# Altium project WTC_SPI_v2.PrjPcb
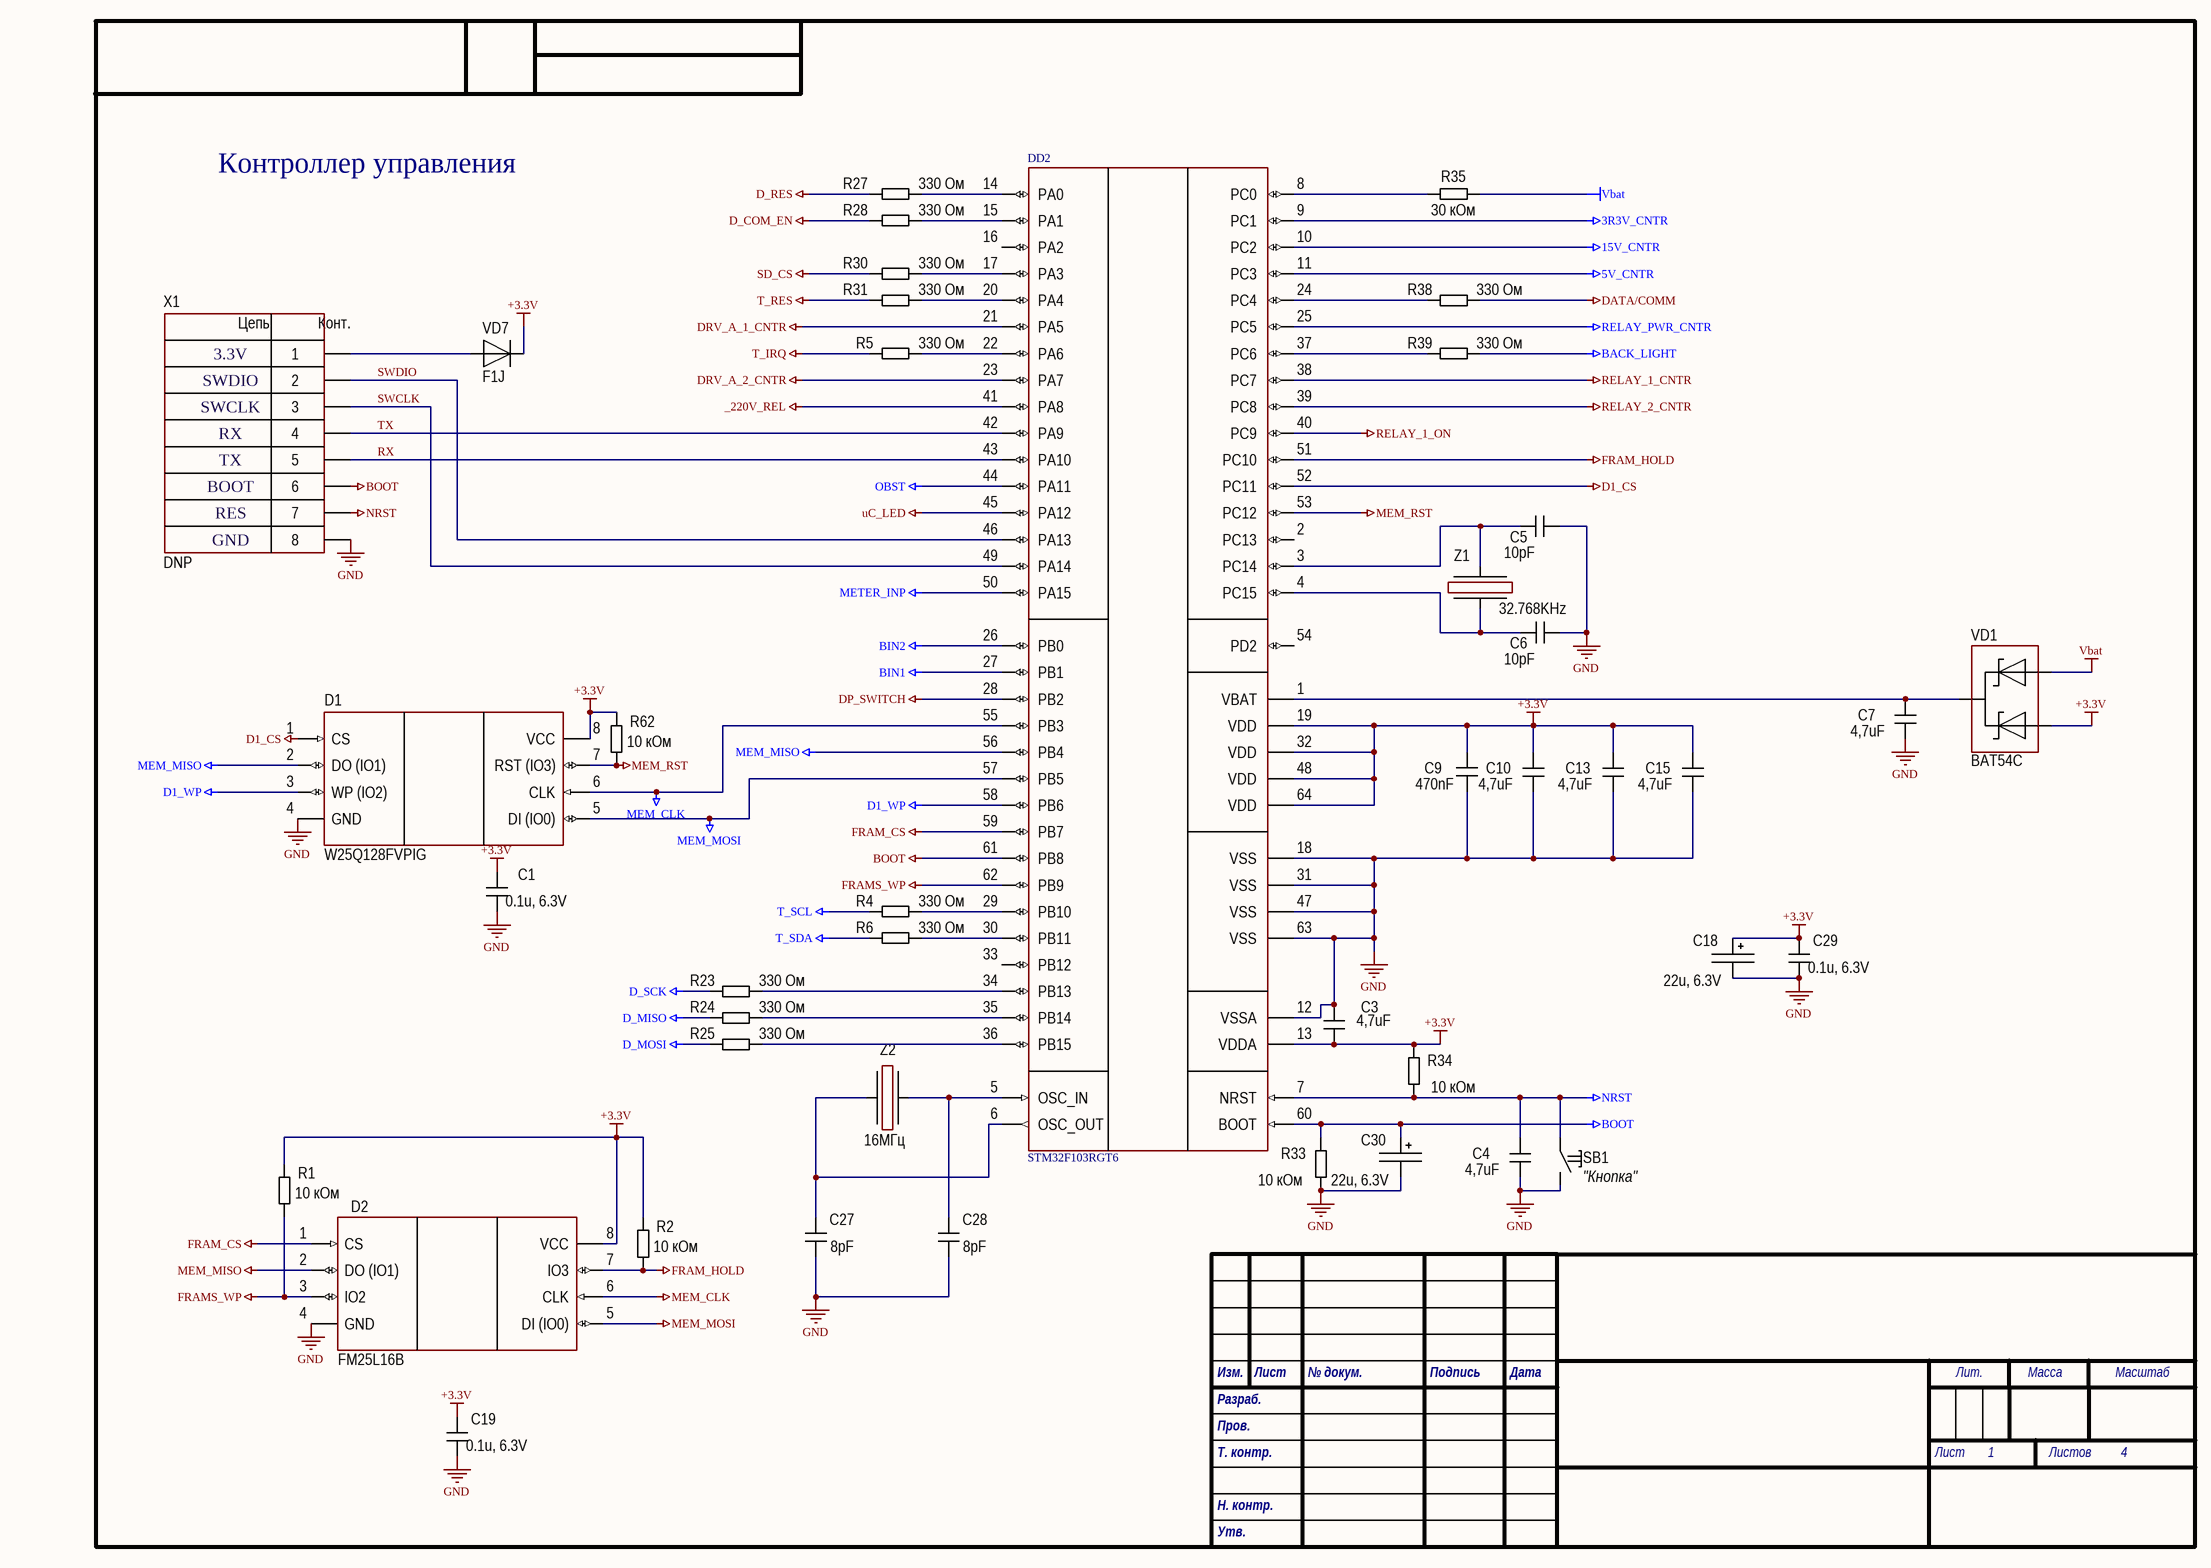
[diagram p0: 1_uC.SchDoc]
4 sheets, 168 parts. Net scope: global (net labels, ports and power ports of the same name join across sheets).
Board file: wtc_spi.PcbDoc
Sheets:
  1_uC.SchDoc
  2_PowerPerif.SchDoc
  3_InfoPerif.SchDoc
  4_PowerSupplie.SchDoc

## Sheet 1_uC.SchDoc
size 414 x 293 mm; SheetNumber: 1; SheetTotal: 4

### Parts
C1  0.1u, 6.3V  [CH0402C]
C3  4,7uF  [CH0402C]
C4  4,7uF  [CH0402C]
C5  10pF  [CH0402C]
C6  10pF  [CH0402C]
C7  4,7uF  [CH0402C]
C9  470nF  [CH0402C]
C10  4,7uF  [CH0402C]
C13  4,7uF  [CH0402C]
C15  4,7uF  [CH0402C]
C18  22u, 6.3V  [TANTAL_A]
C19  0.1u, 6.3V  [CH0402C]
C27  8pF  [CH0402C]
C28  8pF  [CH0402C]
C29  0.1u, 6.3V  [CH0402C]
C30  22u, 6.3V  [TANTAL_A]
D1  W25Q128FVPIG  [8-WSON (5x6mm)without_holes]
D2  FM25L16B  [8-SOIC]
DD2  STM32F103RGT6  [64-LQFP]
R1  10 кОм  [CH0402R]
R2  10 кОм  [CH0402R]
R4  330 Ом  [CH0402R]
R5  330 Ом  [CH0402R]
R6  330 Ом  [CH0402R]
R23  330 Ом  [CH0402R]
R24  330 Ом  [CH0402R]
R25  330 Ом  [CH0402R]
R27  330 Ом  [CH0402R]
R28  330 Ом  [CH0402R]
R30  330 Ом  [CH0402R]
R31  330 Ом  [CH0402R]
R33  10 кОм  [CH0402R]
R34  10 кОм  [CH0402R]
R35  30 кОм  [CH0402R]
R38  330 Ом  [CH0402R]
R39  330 Ом  [CH0402R]
R62  10 кОм  [CH0402R]
SB1  "Кнопка"  [TL1014BF160QG]
VD1  BAT54C  [SOT23_123]
VD7  F1J  [SOD123F]
X1  DNP  [CON: PBS-8]
Z1  32.768KHz  [OSC: 3215]
Z2  16МГц  [OSC: ABM3]

### Nets
3R3V_CNTR: DD2.9(PC1)
5V_CNTR: DD2.11(PC3)
15V_CNTR: DD2.10(PC2)
+3.3V: C1.2 C3.1 C9.1 C10.2 C13.2 C15.2 C18.1 C19.2 C29.2 D1.8(VCC) D2.8(VCC) DD2.13(VDDA) DD2.19(VDD) DD2.32(VDD) DD2.48(VDD) DD2.64(VDD) R1.2 R2.2 R34.2 R62.2 VD1.3 VD7.2
_220V_REL: DD2.41(PA8)
BACK_LIGHT: R39.1
BIN1: DD2.27(PB1)
BIN2: DD2.26(PB0)
BOOT: C30.1 DD2.60(BOOT) DD2.61(PB8) R33.2 X1.6
D1_CS: D1.1(CS) DD2.52(PC11)
D1_WP: D1.3(WP_(IO2)) DD2.58(PB6)
D_COM_EN: R28.1
D_MISO: R24.1
D_MOSI: R25.1
D_RES: R27.1
D_SCK: R23.1
DATA/COMM: R38.1
DP_SWITCH: DD2.28(PB2)
DRV_A_1_CNTR: DD2.21(PA5)
DRV_A_2_CNTR: DD2.23(PA7)
FRAM_CS: D2.1(CS) DD2.59(PB7)
FRAM_HOLD: D2.7(IO3) DD2.51(PC10) R2.1
FRAMS_WP: D2.3(IO2) DD2.62(PB9) R1.1
GND: C1.1 C3.2 C4.1 C5.2 C6.1 C7.1 C9.2 C10.1 C13.1 C15.1 C18.2 C19.1 C27.1 C28.1 C29.1 C30.2 D1.4(GND) D2.4(GND) DD2.12(VSSA) DD2.18(VSS) DD2.31(VSS) DD2.47(VSS) DD2.63(VSS) R33.1 SB1.2 X1.8
MEM_CLK: D1.6(CLK) D2.6(CLK) DD2.55(PB3)
MEM_MISO: D1.2(DO_(IO1)) D2.2(DO_(IO1)) DD2.56(PB4)
MEM_MOSI: D1.5(DI_(IO0)) D2.5(DI_(IO0)) DD2.57(PB5)
MEM_RST: D1.7(RST_(IO3)) DD2.53(PC12) R62.1
METER_INP: DD2.50(PA15)
NRST: C4.2 DD2.7(NRST) R34.1 SB1.1 X1.7
OBST: DD2.44(PA11)
RELAY_1_CNTR: DD2.38(PC7)
RELAY_1_ON: DD2.40(PC9)
RELAY_2_CNTR: DD2.39(PC8)
RELAY_PWR_CNTR: DD2.25(PC5)
RX: DD2.43(PA10) X1.5
SD_CS: R30.1
T_IRQ: R5.1
T_RES: R31.1
T_SCL: R4.1
T_SDA: R6.1
TX: DD2.42(PA9) X1.4
uC_LED: DD2.45(PA12)
Vbat: R35.1 VD1.1
SWCLK: DD2.49(PA14) X1.3
SWDIO: DD2.46(PA13) X1.2
NetC5_1: C5.1 DD2.3(PC14) Z1.3
NetC6_2: C6.2 DD2.4(PC15) Z1.1
NetC7_2: C7.2 DD2.1(VBAT) VD1.2
NetC27_2: C27.2 DD2.6(OSC_OUT) Z2.1
NetC28_2: C28.2 DD2.5(OSC_IN) Z2.3
NetDD2_8: DD2.8(PC0) R35.2
NetDD2_14: DD2.14(PA0) R27.2
NetDD2_15: DD2.15(PA1) R28.2
NetDD2_17: DD2.17(PA3) R30.2
NetDD2_20: DD2.20(PA4) R31.2
NetDD2_22: DD2.22(PA6) R5.2
NetDD2_24: DD2.24(PC4) R38.2
NetDD2_29: DD2.29(PB10) R4.2
NetDD2_30: DD2.30(PB11) R6.2
NetDD2_34: DD2.34(PB13) R23.2
NetDD2_35: DD2.35(PB14) R24.2
NetDD2_36: DD2.36(PB15) R25.2
NetDD2_37: DD2.37(PC6) R39.2
NetVD7_1: VD7.1 X1.1

Not connected (* = marked no-connect by the designer): DD2 2(PC13) 16(PA2) 33(PB12) 54(PD2)

### Notes on the sheet
- Контроллер управления
- 3.3V
- SWDIO
- SWCLK
- RX
- TX
- BOOT
- RES
- GND
- Изм.
- Лист
- № докум.
- Подпись
- Дата
- Лит.
- Масса
- Масштаб
- Пров.
- Разраб.
- Т. контр.
- Н. контр.
- Листов
- Утв.
- (in symbol 8-Connector) Цепь; Конт.

### Library data of the parts
C1 C19 C29 = Capacitor: Model: CC0402KRX7R5BB104; Manufacturer: *; HelpURL: *; ComponentKind: *; Value: *
C3 C4 C7 C10 C13 C15 = Capacitor: 0402; Model: C1005X5R0J475K050BC; Manufacturer: *; HelpURL: *; ComponentKind: *; Value: *
C5 C6 = Capacitor: 0402; Model: 04026D100JAT2A; Manufacturer: *; HelpURL: *; ComponentKind: *; Value: *
C9 = Capacitor: 0402; Model: C0402C474K9RAC7867; Manufacturer: *; HelpURL: *; ComponentKind: *; Value: *
C18 C30 = TantalCap: Model: T494A226M010AT; Manufacturer: *; HelpURL: *; ComponentKind: *; Value: *
C27 C28 = Capacitor: 0402; Model: 04025A8R2JAT2A; Manufacturer: *; HelpURL: *; ComponentKind: *; Value: *
D1 = W25Q128FVPIG: Flash; Manufacturer: Winbond Electronics; Model: W25Q128FVPIG; HelpURL: https://www.digikey.com/product-detail/en/winbond-electronics/W25Q128FVPIG/W25Q128FVPIG-ND/4037386; ComponentKind: 8-WSON
D2 = W25Q80JVSSIQ: Flash; Manufacturer: Winbond Electronics; Model: FM25L16B; HelpURL: https://www.digikey.com/product-detail/en/winbond-electronics/W25Q80JVSSIQ/W25Q80JVSSIQ-ND/6193772; ComponentKind: 8-SOIC
DD2 = STM32F103RCT6: Cortex-M3 (64-LQFP); Model: STM32F103RGT6
R1 R2 R62 = Resistor: 0603; Model: AC0402FR-0710KL; Manufacturer: *; HelpURL: *; ComponentKind: *; Value: *
R4-R6 R23-R25 R27 R28 R30 R31 R38 R39 = Resistor: 0603; Model: RC0402FR-07330RL; Manufacturer: *; HelpURL: *; ComponentKind: *; Value: *
R33 R34 = Resistor: 0805; Model: AC0402FR-0710KL; Manufacturer: *; HelpURL: *; ComponentKind: *; Value: *
R35 = Resistor: 0603; Model: AC0402FR-0730KL; Manufacturer: *; HelpURL: *; ComponentKind: *; Value: *
SB1 = Tactile switches: 6x6 mm; Manufacturer: *; Model: TL1014BF160QG; HelpURL: *; ComponentKind: *
VD1 = Diod Schottky Array v.1: SOT-23; ComponentKind: *; Manufacturer: *; Model: BAT54C; HelpURL: *
VD7 = Diod: ComponentKind: *; Manufacturer: *; Model: F1J; HelpURL: *
X1 = 8-Connector: Pin header 8; Model: DNP; Manufacturer: *; HelpURL: *; ComponentKind: *
Z1 = Oscillator: Model: Q 0,032768-JTX310-12,5-20-T1-LF; Manufacturer: *; HelpURL: *; ComponentKind: *; Value: *
Z2 = Oscillator: NX5032GA-16.000000MHZ-LN-CD-1; Manufacturer: *; Model: NX5032GA-16.000000MHZ-LN-CD-1; HelpURL: *; ComponentKind: *; Value: *

## Sheet 2_PowerPerif.SchDoc
size 414 x 293 mm; SheetNumber: 2; SheetTotal: 4
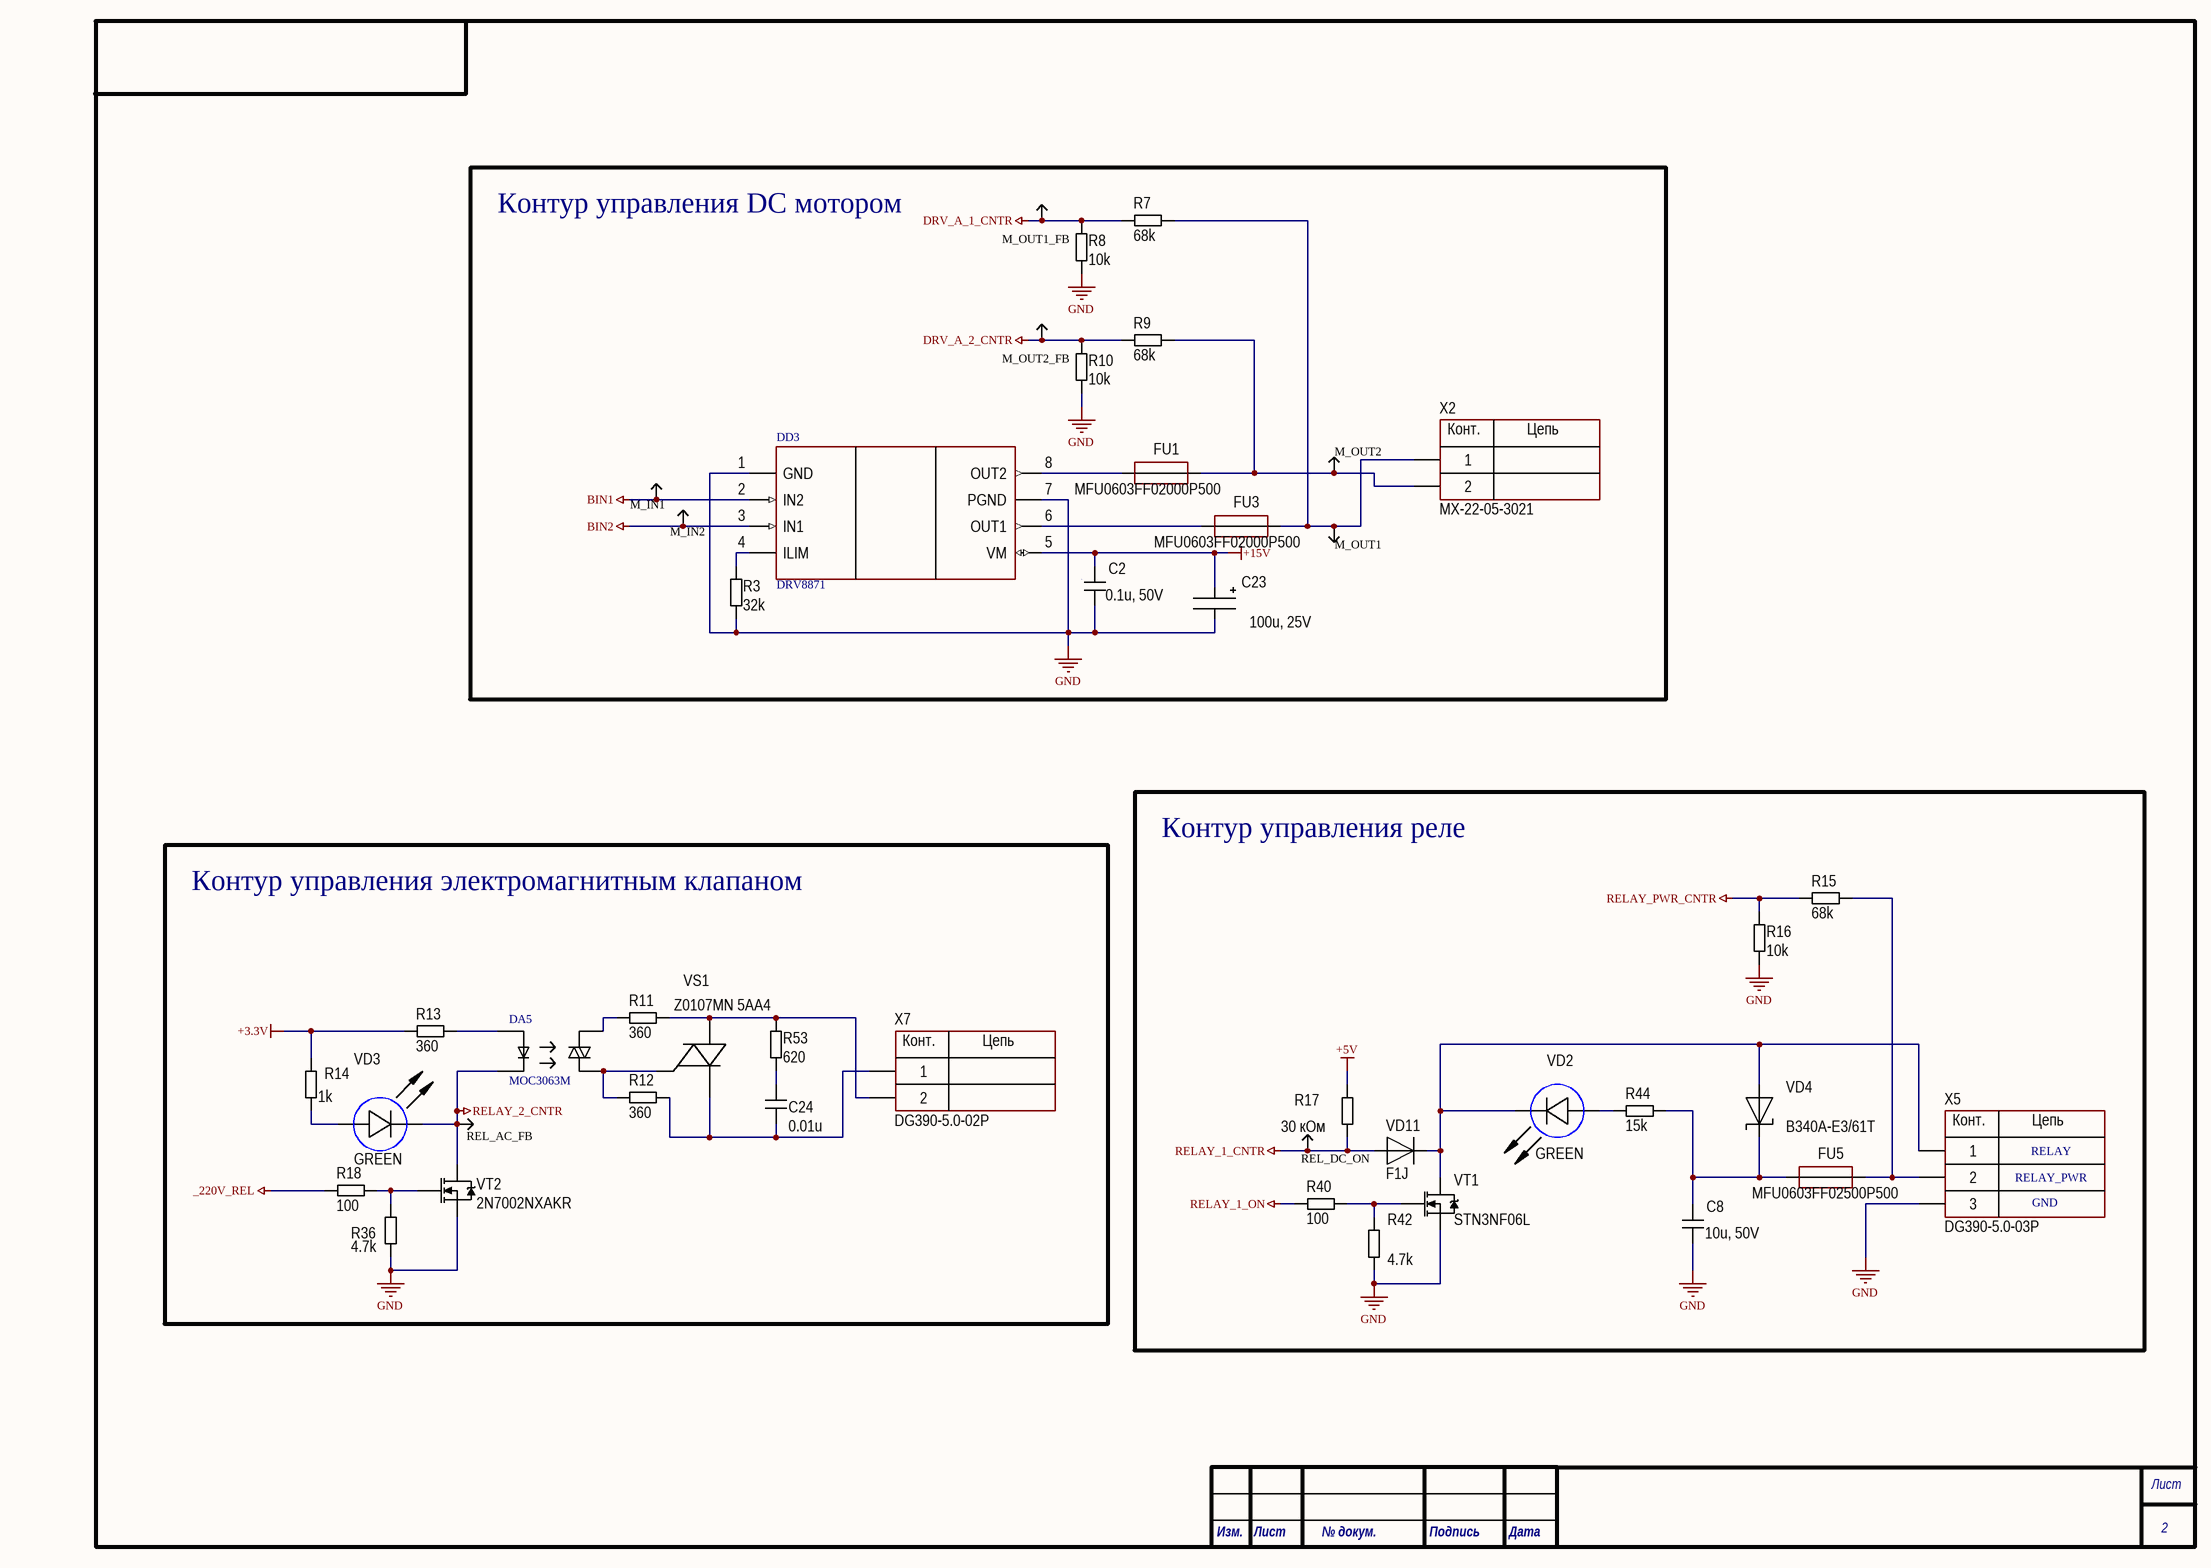
[diagram p1: 2_PowerPerif.SchDoc]

### Parts
C2  0.1u, 50V  [CH0402C]
C8  10u, 50V  [CH1206C]
C23  100u, 25V  [D6.6C6.6H6.1]
C24  0.01u  [CH1210C]
DA5  MOC3063M  [DIP6]
DD3  DRV8871  [8-HSOP]
FU1  MFU0603FF02000P500  [CH0603F]
FU3  MFU0603FF02000P500  [CH0603F]
FU5  MFU0603FF02500P500  [CH0603F]
M_IN1  (no value)  [TestPoint]
M_IN2  (no value)  [TestPoint]
M_OUT1  (no value)  [TestPoint]
M_OUT1_FB  (no value)  [TestPoint]
M_OUT2  (no value)  [TestPoint]
M_OUT2_FB  (no value)  [TestPoint]
R3  32k  [CH0603R]
R7  68k  [CH0402R]
R8  10k  [CH0402R]
R9  68k  [CH0402R]
R10  10k  [CH0402R]
R11  360  [CH2010R]
R12  360  [CH2010R]
R13  360  [CH0805R]
R14  1k  [CH0805R]
R15  68k  [CH0402R]
R16  10k  [CH0402R]
R17  30 кОм  [CH0402R]
R18  100  [CH0805R]
R36  4.7k  [CH0402R]
R40  100  [CH0805R]
R42  4.7k  [CH0402R]
R44  15k  [CH0805R]
R53  620  [CH2010R]
REL_AC_FB  (no value)  [TestPoint]
REL_DC_ON  (no value)  [TestPoint]
VD2  GREEN  [CH0603LB]
VD3  GREEN  [CH0603LB]
VD4  B340A-E3/61T  [SMA]
VD11  F1J  [SOD123F]
VS1  Z0107MN 5AA4  [SOT223_G-D-S]
VT1  STN3NF06L  [SOT223_G-D-S]
VT2  2N7002NXAKR  [SOT23_123]
X2  MX-22-05-3021  [CON: MX-22-05-3021]
X5  DG390-5.0-03P  [CON: 300-03P-5.0]
X7  DG390-5.0-02P  [CON: 300-02P-5.0]

### Blocks framed on the sheet
Контур управления DC мотором: C2 C23 DD3 FU1 FU3 M_IN1 M_IN2 M_OUT1 M_OUT1_FB M_OUT2 M_OUT2_FB R3 R7-R10 X2
Контур управления реле: C8 FU5 R15-R17 R40 R42 R44 REL_DC_ON VD2 VD4 VD11 VT1 X5
Контур управления электромагнитным клапаном: C24 DA5 R11-R14 R18 R36 R53 REL_AC_FB VD3 VS1 VT2 X7

### Nets
+3.3V: R13.2 R14.2
+5V: R17.2
+15V: C2.2 C23.1 DD3.5(VM)
_220V_REL: R18.2
BIN1: DD3.2(IN2) M_IN1.0
BIN2: DD3.3(IN1) M_IN2.0
DRV_A_1_CNTR: M_OUT1_FB.0 R7.2 R8.2
DRV_A_2_CNTR: M_OUT2_FB.0 R9.2 R10.2
GND: C2.1 C8.1 C23.2 DD3.1(GND) DD3.7(PGND) R3.1 R8.1 R10.1 R16.1 R36.1 R42.1 VT1.3(S) VT2.3(S) X5.3
RELAY_1_CNTR: R17.1 REL_DC_ON.0 VD11.1
RELAY_1_ON: R40.2
RELAY_2_CNTR: DA5.2(Vpr-) REL_AC_FB.0 VD3.2(C) VT2.2(D)
RELAY_PWR_CNTR: R15.2 R16.2
NetC8_2: C8.2 FU5.1 R44.2 VD4.2
NetC24_1: C24.1 R12.1 VS1.1 X7.1
NetC24_2: C24.2 R53.2
NetDA5_1: DA5.1(Vpr+) R13.1
NetDA5_4: DA5.4 R11.2
NetDA5_6: DA5.6 R12.2 VS1.3
NetDD3_4: DD3.4(ILIM) R3.2
NetDD3_6: DD3.6(OUT1) FU3.1
NetDD3_8: DD3.8(OUT2) FU1.1
NetFU1_2: FU1.2 M_OUT2.0 R9.1 X2.2
NetFU3_2: FU3.2 M_OUT1.0 R7.1 X2.1
NetFU5_2: FU5.2 R15.1 X5.2
NetR11_1: R11.1 R53.1 VS1.2 X7.2
NetR14_1: R14.1 VD3.1(A)
NetR18_1: R18.1 R36.2 VT2.1(G)
NetR40_1: R40.1 R42.2 VT1.1(G)
NetR44_1: R44.1 VD2.1(A)
NetVD2_2: VD2.2(C) VD4.1 VD11.2 VT1.2(D) X5.1

### Notes on the sheet
- RELAY
- RELAY_PWR
- GND
- Лист
- Изм.
- № докум.
- Подпись
- Дата
- (in symbol 2-Connector) Конт.; Цепь
- (in symbol 3-Connector) Конт.; Цепь

### Library data of the parts
C2 = Capacitor: Model: 04025C104KAT2A; Manufacturer: *; HelpURL: *; ComponentKind: *; Value: *
C8 = Capacitor: Model: CL31B106KBHNNNE; Manufacturer: *; HelpURL: *; ComponentKind: *; Value: *
C23 = AlumCap: Model: JCK1V101M063077; Value: JCK1V101M063077; Manufacturer: *; HelpURL: *; ComponentKind: *
C24 = Capacitor: Model: GRM32QR73A103KW; Manufacturer: *; HelpURL: *; ComponentKind: *; Value: 0.01u
DA5 = MOC3063: Model: MOC3063M
FU1 FU3 FU5 = Fuse: Manufacturer: *; HelpURL: *; ComponentKind: *; Value: *
  FU1 FU3: Model: MFU0603FF02000P500
  FU5: Model: MFU0603FF02500P500
M_IN1 M_IN2 M_OUT1 M_OUT1_FB M_OUT2 M_OUT2_FB REL_AC_FB REL_DC_ON = TestPoint: Model: DNP
R3 = Resistor: Model: AC0603FR-0732K4L; Manufacturer: *; HelpURL: *; ComponentKind: *; Value: *
R7 R9 R15 = Resistor: Model: AC0402FR-0768KL; Manufacturer: *; HelpURL: *; ComponentKind: *; Value: *
R8 R10 R16 = Resistor: Model: AC0402FR-0710KL; Manufacturer: *; HelpURL: *; ComponentKind: *; Value: *
R11 R12 = Resistor: Model: AC2010FK-07360RL; Value: AC2010FK-07360RL; Manufacturer: *; HelpURL: *; ComponentKind: *
R13 = Resistor: Model: AC0805FR-07360RL; Manufacturer: *; HelpURL: *; ComponentKind: *; Value: *
R14 = Resistor: Model: AC0805FR-071KL; Manufacturer: *; HelpURL: *; ComponentKind: *; Value: *
R17 = Resistor: Model: AC0402FR-0730KL; Value: AC0402FR-0730KL; Manufacturer: *; HelpURL: *; ComponentKind: *
R18 R40 = Resistor: Model: AC0805FR-7W100RL; Manufacturer: *; HelpURL: *; ComponentKind: *; Value: *
R36 R42 = Resistor: Model: AC0402FR-074K7L; Manufacturer: *; HelpURL: *; ComponentKind: *; Value: *
R44 = Resistor: Model: AC0805FR-0715KL; Manufacturer: *; HelpURL: *; ComponentKind: *; Value: *
R53 = Resistor: Model: AC2010FK-07620RL; Value: AC2010FK-07620RL; Manufacturer: *; HelpURL: *; ComponentKind: *
VD2 VD3 = LED_1: Model: B1911NG; Manufacturer: *; HelpURL: *; ComponentKind: *; Value: *
VD4 = Diod Schottky: ComponentKind: *; Manufacturer: *; Model: B340A-E3/61T; HelpURL: *
VD11 = Diod: ComponentKind: *; Manufacturer: *; Model: F1J; HelpURL: *
VS1 = TRIAC: Bipolar; Model: Z0107MN 5AA4; Manufacturer: *; ComponentKind: *; HelpURL: *
VT1 VT2 = N-chanel: Mosfet; Manufacturer: *; ComponentKind: *; HelpURL: *
  VT1: Model: STN3NF06L
  VT2: Model: 2N7002NXAKR
X2 X7 = 2-Connector: Manufacturer: *; HelpURL: *; ComponentKind: *
  X2: Model: MX-22-05-3021
  X7: Model: DG390-5.0-02P
X5 = 3-Connector: Model: DG390-5.0-03P; Manufacturer: *; HelpURL: *; ComponentKind: *
DD3 = DRV8871: Model: DRV8871

## Sheet 3_InfoPerif.SchDoc
size 414 x 293 mm; SheetNumber: 3; SheetTotal: 4
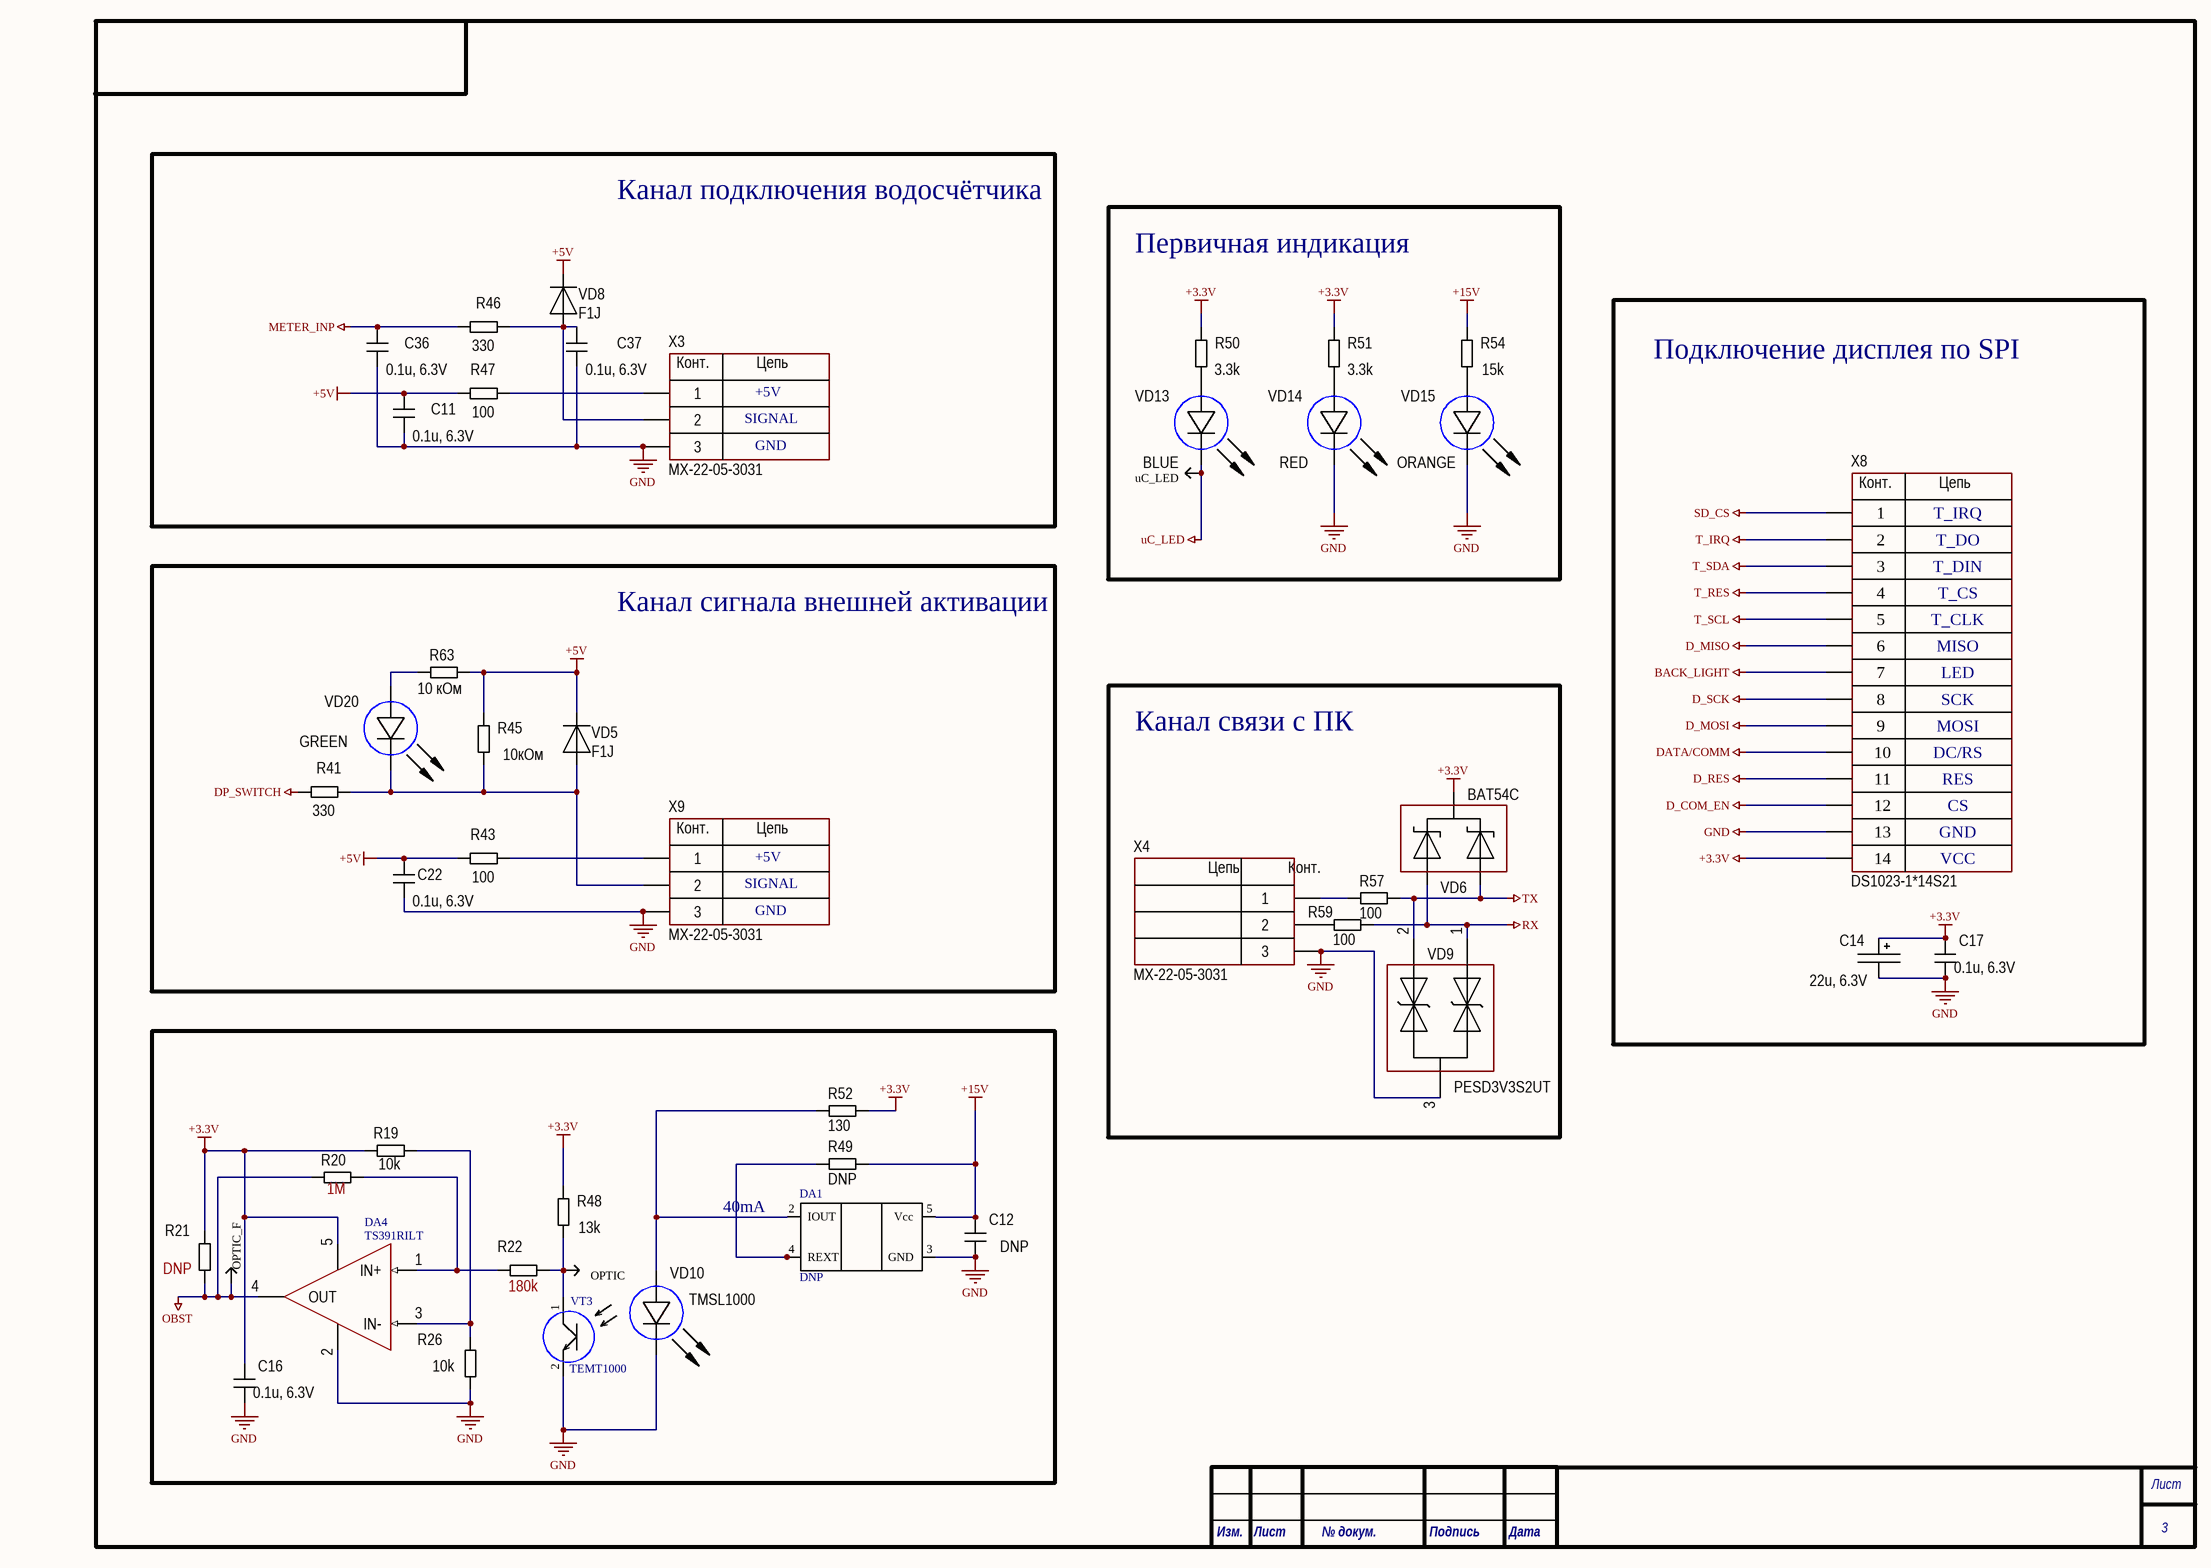
[diagram p2: 3_InfoPerif.SchDoc]

### Parts
C11  0.1u, 6.3V  [CH0603C]
C12  DNP  [CH0402C]
C14  22u, 6.3V  [TANTAL_A]
C16  0.1u, 6.3V  [CH0402C]
C17  0.1u, 6.3V  [CH0402C]
C22  0.1u, 6.3V  [CH0402C]
C36  0.1u, 6.3V  [CH0402C]
C37  0.1u, 6.3V  [CH0402C]
DA1  DNP  [SOT353]
DA4  TS391RILT  [SOT23-5]
OPTIC  (no value)  [TestPoint]
OPTIC_F  (no value)  [TestPoint]
R19  10k  [CH0402R]
R20  1M  [CH0402R]
R21  DNP  [CH0402R]
R22  180k  [CH0402R]
R26  10k  [CH0402R]
R41  330  [CH0402R]
R43  100  [CH0805R]
R45  10кОм  [CH0603R]
R46  330  [CH0402R]
R47  100  [CH0805R]
R48  13k  [CH0402R]
R49  DNP  [CH0805R]
R50  3.3k  [CH0805R]
R51  3.3k  [CH0805R]
R52  130  [CH0805R]
R54  15k  [CH0805R]
R57  100  [CH0402R]
R59  100  [CH0402R]
R63  10 кОм  [CH0805R]
uC_LED  (no value)  [TestPoint]
VD5  F1J  [SOD123F]
VD6  BAT54C  [SOT23_123]
VD8  F1J  [SOD123F]
VD9  PESD3V3S2UT  [SOT23_132]
VD10  TMSL1000  [TSML1000]
VD13  BLUE  [CH0603LB]
VD14  RED  [CH0603LB]
VD15  ORANGE  [CH0603LB]
VD20  GREEN  [CH0603LB]
VT3  TEMT1000  [TEMT1000]
X3  MX-22-05-3031  [CON: MX-22-05-3031]
X4  MX-22-05-3031  [CON: MX-22-05-3031]
X8  DS1023-1*14S21  [DS1024-14]
X9  MX-22-05-3031  [CON: MX-22-05-3031]

### Blocks framed on the sheet
Канал подключения водосчётчика: C11 C36 C37 R46 R47 VD8 X3
Первичная индикация: R50 R51 R54 uC_LED VD13-VD15
Подключение дисплея по SPI: C14 C17 X8
Канал сигнала внешней активации: C22 R41 R43 R45 R63 VD5 VD20 X9
Канал связи с ПК: R57 R59 VD6 VD9 X4
40mA: C12 C16 DA1 DA4 OPTIC OPTIC_F R19-R22 R26 R48 R49 R52 VD10 VT3

### Nets
+3.3V: C14.1 C16.2 C17.2 DA4.5(V+) R19.2 R21.2 R48.2 R50.2 R51.2 R52.2 VD6.2 X8.14
+5V: C11.2 C22.2 R43.1 R45.1 R47.1 R63.2 VD5.2 VD8.2
+15V: C12.2 DA1.5(Vcc) R49.2 R54.2
BACK_LIGHT: X8.7
D_COM_EN: X8.12
D_MISO: X8.6
D_MOSI: X8.9
D_RES: X8.11
D_SCK: X8.8
DATA/COMM: X8.10
DP_SWITCH: R41.1
GND: C11.1 C12.1 C14.2 C16.1 C17.1 C22.1 C36.1 C37.1 DA1.3(GND) DA4.2(V-) R26.1 VD9.3 VD10.2(C) VD14.2(C) VD15.2(C) VT3.2 X3.3 X4.3 X8.13 X9.3
METER_INP: C36.2 R46.1
OBST: DA4.4(OUT) OPTIC_F.0 R20.2 R21.1
RX: R59.2 VD6.3 VD9.1
SD_CS: X8.1
T_IRQ: X8.2
T_RES: X8.4
T_SCL: X8.5
T_SDA: X8.3
TX: R57.2 VD6.1 VD9.2
uC_LED: uC_LED.0 VD13.2(C)
NetC37_2: C37.2 R46.2 VD8.1 X3.2
NetDA1_2: DA1.2(IOUT) R52.1 VD10.1(A)
NetDA1_4: DA1.4(REXT) R49.1
NetDA4_1: DA4.1(IN+) R20.1 R22.2
NetDA4_3: DA4.3(IN-) R19.1 R26.2
NetOPTIC_0: OPTIC.0 R22.1 R48.1 VT3.1
NetR41_2: R41.2 R45.2 VD5.1 VD20.2(C) X9.2
NetR43_2: R43.2 X9.1
NetR47_2: R47.2 X3.1
NetR50_1: R50.1 VD13.1(A)
NetR51_1: R51.1 VD14.1(A)
NetR54_1: R54.1 VD15.1(A)
NetR57_1: R57.1 X4.1
NetR59_1: R59.1 X4.2
NetR63_1: R63.1 VD20.1(A)

### Notes on the sheet
- SIGNAL
- +5V
- GND
- T_IRQ
- T_DO
- T_DIN
- T_CS
- T_CLK
- MISO
- LED
- SCK
- MOSI
- DC/RS
- RES
- CS
- VCC
- Лист
- Изм.
- № докум.
- Подпись
- Дата
- (in symbol 14-Connector) Конт.; Цепь
- (in symbol 4-Connector) Конт.; Цепь

### Library data of the parts
C11 = Capacitor: 0805; Model: 06035C104KAT2A; Manufacturer: *; HelpURL: *; ComponentKind: *; Value: *
C12 = Capacitor: 0805; Manufacturer: *; Model: DNP; HelpURL: *; ComponentKind: *; Value: DNP
C14 = TantalCap: Model: T494A226M010AT; Manufacturer: *; HelpURL: *; ComponentKind: *; Value: *
C16 C22 C36 C37 = Capacitor: 0805; Model: CC0402KRX7R5BB104; Manufacturer: *; HelpURL: *; ComponentKind: *; Value: *
C17 = Capacitor: Model: CC0402KRX7R5BB104; Manufacturer: *; HelpURL: *; ComponentKind: *; Value: *
DA1 = PSSI2021SAY: Iout = 0.617/Rext + 15 µA; Model: DNP
DA4 = LMV331M5: SOT23-5; Model: TS391RILT
OPTIC OPTIC_F uC_LED = TestPoint: Model: DNP
R19 R26 = Resistor: Model: AC0402FR-0710KL; Manufacturer: *; HelpURL: *; ComponentKind: *; Value: *
R20 = Resistor: Model: AC0402FR-071ML; Manufacturer: *; HelpURL: *; ComponentKind: *; Value: *
R21 = Resistor: Manufacturer: *; Model: DNP; HelpURL: *; ComponentKind: *; Value: DNP
R22 = Resistor: Model: AC0402FR-07180KL; Manufacturer: *; HelpURL: *; ComponentKind: *; Value: *
R41 R46 = Resistor: Model: RC0402FR-07330RL; Manufacturer: *; HelpURL: *; ComponentKind: *; Value: *
R43 R47 = Resistor: Model: AC0805FR-7W100RL; Manufacturer: *; HelpURL: *; ComponentKind: *; Value: *
R45 = Resistor: Model: AC0603FR-0710KL; Manufacturer: *; HelpURL: *; ComponentKind: *; Value: *
R48 = Resistor: 0805; Model: AC0402FR-0713KL; Manufacturer: *; HelpURL: *; ComponentKind: *; Value: *
R49 = Resistor: 0805; Manufacturer: *; Model: DNP; HelpURL: *; ComponentKind: *; Value: DNP
R50 R51 = Resistor: Model: AC0805FR-073K3L; Manufacturer: *; HelpURL: *; ComponentKind: *; Value: *
R52 = Resistor: 0805; Model: AC0805FR-7W130RL; Manufacturer: *; HelpURL: *; ComponentKind: *; Value: 130
R54 = Resistor: Model: AC0805FR-0715KL; Manufacturer: *; HelpURL: *; ComponentKind: *; Value: *
R57 R59 = Resistor: Model: AC0402FR-07100RL; Manufacturer: *; HelpURL: *; ComponentKind: *; Value: *
R63 = Resistor: Model: AC0805FR-0710K5L; Manufacturer: *; HelpURL: *; ComponentKind: *; Value: *
VD5 VD8 = Diod: ComponentKind: *; Manufacturer: *; Model: F1J; HelpURL: *
VD6 = Diod Schottky Array v.1: ComponentKind: *; Manufacturer: *; Model: BAT54C; HelpURL: *
VD9 = TVS Array: ComponentKind: *; Manufacturer: *; Model: PESD3V3S2UT; HelpURL: *
VD10 = LED_1: Manufacturer: *; Model: TMSL1000; HelpURL: *; ComponentKind: *; Value: *
VD13 = LED_1: Model: B1911NB; Manufacturer: *; HelpURL: *; ComponentKind: *; Value: *
VD14 = LED_1: Model: B1911USD; Manufacturer: *; HelpURL: *; ComponentKind: *; Value: *
VD15 = LED_1: Model: B1911UD; Manufacturer: *; HelpURL: *; ComponentKind: *; Value: *
VD20 = LED_1: Model: B1911NG; Manufacturer: *; HelpURL: *; ComponentKind: *; Value: *
X3 X4 X9 = 3-Connector: Model: MX-22-05-3031; Manufacturer: *; HelpURL: *; ComponentKind: *
X8 = 14-Connector: Model: DS1023-1*14S21; Manufacturer: *; HelpURL: *; ComponentKind: *
VT3 = TEMT1000: Model: TEMT1000

## Sheet 4_PowerSupplie.SchDoc
size 414 x 293 mm; SheetNumber: 4; SheetTotal: 4; PageSetup: Record=PageOptionsZCenterHorizontal=TrueZCenterVertical=TrueZPrintScale=1.00ZXCorrection=0.00ZYCorrection=0.00ZPrintKind=1ZBorderSize=5000000ZLeftOffset=0ZBottomOffset=0ZOrientation=2ZPaperLength=1000ZPaperWidth=1000ZScale=100ZPaperSource=7ZPrintQuality=-4ZMediaType=1ZDitherType=10ZPaperKind=A3ZPrintScaleMode=0; Razrabotal: {Разработал}; Proveril: {Проверил}; Tkontr: {Т.контр.}; Nkontr: {Н.контр.}; Ytverdil: {Утвердил}; Nazvanie1: {Название1}; Nazvanie2: {Название2}; Oboznachenie: {Обозначение}
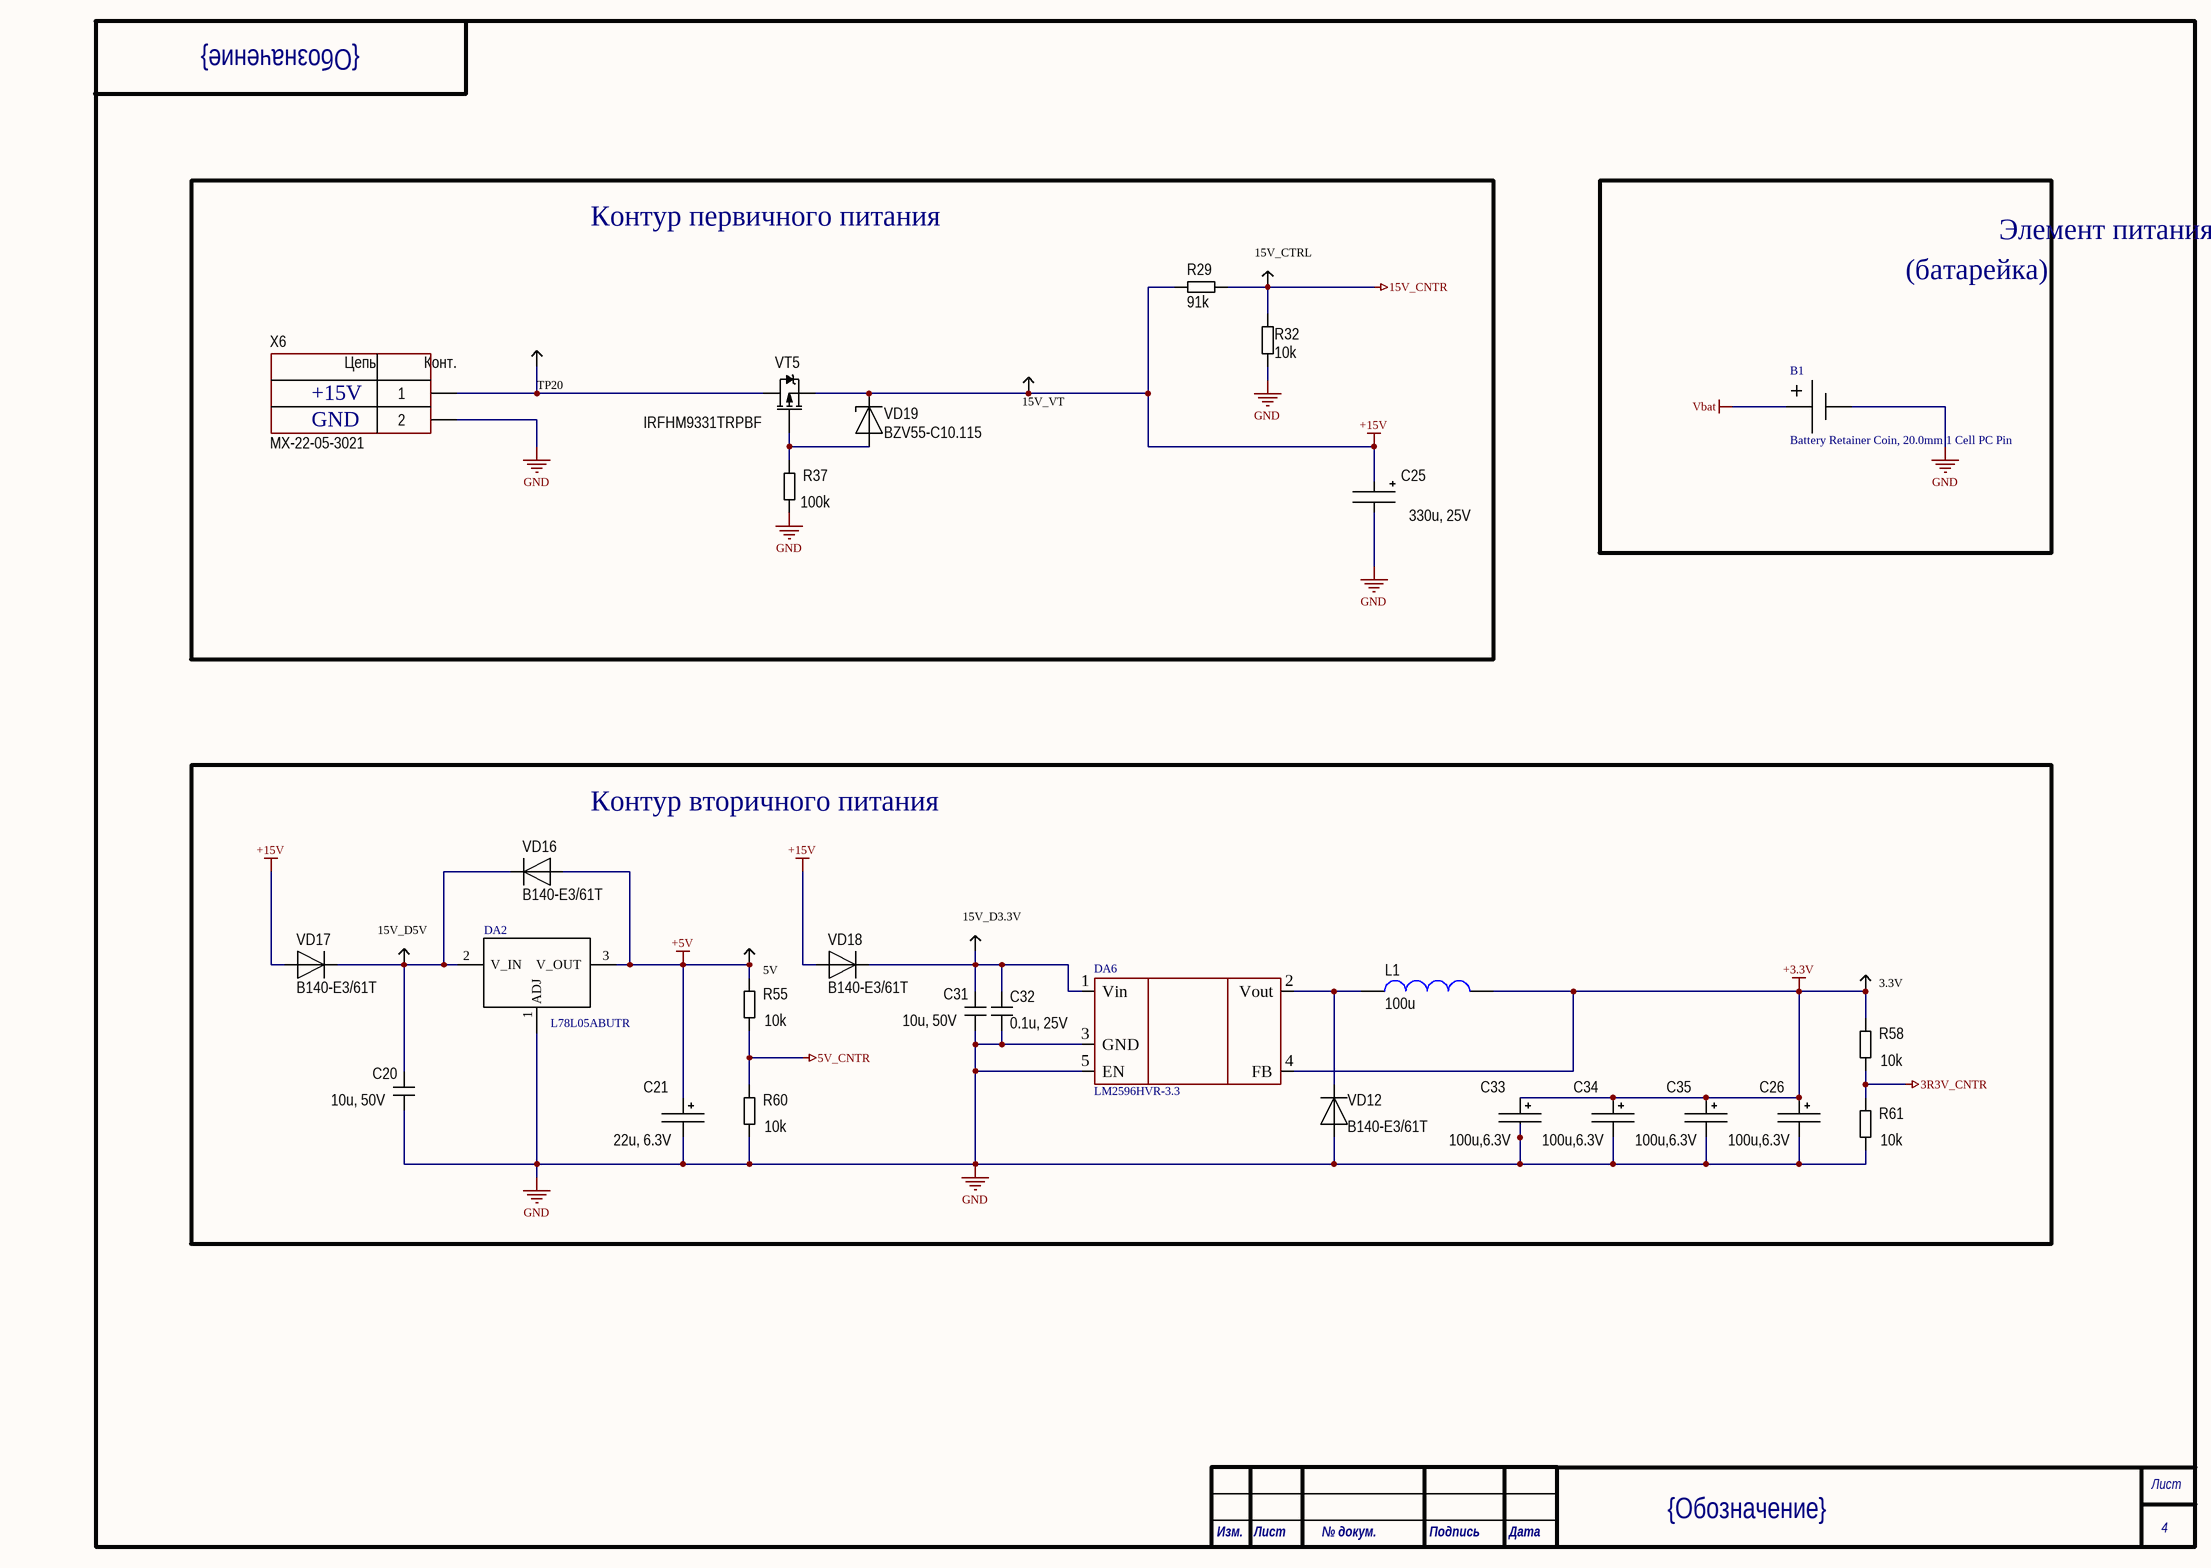
[diagram p3: 4_PowerSupplie.SchDoc]

### Parts
3.3V  (no value)  [TestPoint]
5V  (no value)  [TestPoint]
15V_CTRL  (no value)  [TestPoint]
15V_D3.3V  (no value)  [TestPoint]
15V_D5V  (no value)  [TestPoint]
15V_VT  (no value)  [TestPoint]
B1  Battery Retainer Coin, 20.0mm 1 Cell PC Pin  [BAT: CR2032_SM]
C20  10u, 50V  [CH1206C]
C21  22u, 6.3V  [TANTAL_A]
C25  330u, 25V  [D10C4.4H10]
C26  100u,6.3V  [TANTAL_C]
C31  10u, 50V  [CH1206C]
C32  0.1u, 25V  [CH0603C]
C33  100u,6.3V  [TANTAL_C]
C34  100u,6.3V  [TANTAL_C]
C35  100u,6.3V  [TANTAL_C]
DA2  L78L05ABUTR  [SOT89_PC12120]
DA6  LM2596HVR-3.3  [TO263S-5+1]
L1  100u  [IND: B82477G4]
R29  91k  [CH0402R]
R32  10k  [CH0402R]
R37  100k  [CH0402R]
R55  10k  [CH0402R]
R58  10k  [CH0402R]
R60  10k  [CH0402R]
R61  10k  [CH0402R]
TP20  (no value)  [TestPoint]
VD12  B140-E3/61T  [SMA]
VD16  B140-E3/61T  [SMA]
VD17  B140-E3/61T  [SMA]
VD18  B140-E3/61T  [SMA]
VD19  BZV55-C10.115  [SOD80]
VT5  IRFHM9331TRPBF  [PQFN-3x3]
X6  MX-22-05-3021  [CON: MX-22-05-3021]

### Blocks framed on the sheet
Контур первичного питания: 15V_CTRL 15V_VT C25 R29 R32 R37 TP20 VD19 VT5 X6
Контур вторичного питания: 3.3V 5V 15V_D3.3V 15V_D5V C20 C21 C26 C31-C35 DA2 DA6 L1 R55 R58 R60 R61 VD12 VD16-VD18

### Nets
3R3V_CNTR: R58.1 R61.2
5V_CNTR: R55.1 R60.2
15V_CNTR: 15V_CTRL.0 R29.1 R32.1
+3.3V: 3.3V.0 C26.1 C33.1 C34.1 C35.1 DA6.4(FB) L1.1 R58.2
+5V: 5V.0 C21.1 DA2.3(V_OUT) R55.2 VD16.1
+15V: 15V_VT.0 C25.1 R29.2 VD17.1 VD18.1 VD19.2(C) VT5.3(S)
GND: B1.2 C20.1 C21.2 C25.2 C26.2 C31.1 C32.1 C33.2 C34.2 C35.2 DA2.1(ADJ) DA6.3(GND) DA6.5(EN) R32.2 R37.1 R60.1 R61.1 VD12.1 X6.2
Vbat: B1.1
Net15V_D3.3V_0: 15V_D3.3V.0 C31.2 C32.2 DA6.1(Vin) VD18.2
Net15V_D5V_0: 15V_D5V.0 C20.2 DA2.2(V_IN) VD16.2 VD17.2
NetDA6_2: DA6.2(Vout) L1.2 VD12.2
NetR37_2: R37.2 VD19.1(A) VT5.1(G)
NetTP20_0: TP20.0 VT5.2(D) X6.1

### Notes on the sheet
- (батарейка)
- Элемент питания CR2032
- +15V
- GND
- Лист
- Изм.
- № докум.
- Подпись
- Дата
- (in symbol 2-Connector) Цепь; Конт.

### Library data of the parts
3.3V 5V 15V_CTRL 15V_D3.3V 15V_D5V 15V_VT TP20 = TestPoint: Model: DNP
B1 = Battery_CR2032: Battery Retainer Coin, 20.0mm 1 Cell PC Pin, Keystone Electronics; Model: 3044; Parameter 1: *
C20 C31 = Capacitor: Model: CL31B106KBHNNNE; Manufacturer: *; HelpURL: *; ComponentKind: *; Value: *
C21 = TantalCap: Model: T494A226M010AT; Manufacturer: *; HelpURL: *; ComponentKind: *; Value: *
C25 = AlumCap: Model: EEE-FT1H331AP; Manufacturer: *; HelpURL: *; ComponentKind: *; Value: *
C26 C33-C35 = TantalCap: Model: 593D107X9010C2TE3; Manufacturer: *; HelpURL: *; ComponentKind: *; Value: *
C32 = Capacitor: Model: 06035C104KAT2A; Manufacturer: *; HelpURL: *; ComponentKind: *; Value: 0.1u, 25V
DA2 = LM1117: Model: L78L05ABUTR
DA6 = LM2575HV: Model: LM2596HVR-3.3
L1 = Inductor: Model: B82477G4104M000; Manufacturer: *; HelpURL: *; ComponentKind: *; Value: 100u
R29 = Resistor: Model: AC0402FR-0791KL; Manufacturer: *; HelpURL: *; ComponentKind: *; Value: *
R32 R55 R58 R60 R61 = Resistor: Model: AC0402FR-0710KL; Manufacturer: *; HelpURL: *; ComponentKind: *; Value: *
R37 = Resistor: Model: AC0402FR-07100KL; Manufacturer: *; HelpURL: *; ComponentKind: *; Value: *
VD12 VD16-VD18 = Diod: ComponentKind: *; Manufacturer: *; Model: B140-E3/61T; HelpURL: *
VD19 = Diod Zener: ComponentKind: *; Manufacturer: *; Model: BZV55-C10.115; HelpURL: *
VT5 = P-chanel: Mosfet; Model: IRFHM9331TRPBF; Manufacturer: *; ComponentKind: *; HelpURL: *
X6 = 2-Connector: Model: MX-22-05-3021; Manufacturer: *; HelpURL: *; ComponentKind: *

## Nets that join several sheets
3R3V_CNTR: 1_uC (DD2.9), 4_PowerSupplie (R58.1 R61.2)
5V_CNTR: 1_uC (DD2.11), 4_PowerSupplie (R55.1 R60.2)
15V_CNTR: 1_uC (DD2.10), 4_PowerSupplie (15V_CTRL.0 R29.1 R32.1)
+3.3V: 1_uC (22 pins), 2_PowerPerif (R13.2 R14.2), 3_InfoPerif (12 pins), 4_PowerSupplie (8 pins)
+5V: 2_PowerPerif (R17.2), 3_InfoPerif (8 pins), 4_PowerSupplie (5 pins)
+15V: 2_PowerPerif (C2.2 C23.1 DD3.5), 3_InfoPerif (C12.2 DA1.5 R49.2 R54.2), 4_PowerSupplie (7 pins)
_220V_REL: 1_uC (DD2.41), 2_PowerPerif (R18.2)
BACK_LIGHT: 1_uC (R39.1), 3_InfoPerif (X8.7)
BIN1: 1_uC (DD2.27), 2_PowerPerif (DD3.2 M_IN1.0)
BIN2: 1_uC (DD2.26), 2_PowerPerif (DD3.3 M_IN2.0)
D_COM_EN: 1_uC (R28.1), 3_InfoPerif (X8.12)
D_MISO: 1_uC (R24.1), 3_InfoPerif (X8.6)
D_MOSI: 1_uC (R25.1), 3_InfoPerif (X8.9)
D_RES: 1_uC (R27.1), 3_InfoPerif (X8.11)
D_SCK: 1_uC (R23.1), 3_InfoPerif (X8.8)
DATA/COMM: 1_uC (R38.1), 3_InfoPerif (X8.10)
DP_SWITCH: 1_uC (DD2.28), 3_InfoPerif (R41.1)
DRV_A_1_CNTR: 1_uC (DD2.21), 2_PowerPerif (M_OUT1_FB.0 R7.2 R8.2)
DRV_A_2_CNTR: 1_uC (DD2.23), 2_PowerPerif (M_OUT2_FB.0 R9.2 R10.2)
GND: 1_uC (26 pins), 2_PowerPerif (14 pins), 3_InfoPerif (20 pins), 4_PowerSupplie (19 pins)
METER_INP: 1_uC (DD2.50), 3_InfoPerif (C36.2 R46.1)
OBST: 1_uC (DD2.44), 3_InfoPerif (DA4.4 OPTIC_F.0 R20.2 R21.1)
RELAY_1_CNTR: 1_uC (DD2.38), 2_PowerPerif (R17.1 REL_DC_ON.0 VD11.1)
RELAY_1_ON: 1_uC (DD2.40), 2_PowerPerif (R40.2)
RELAY_2_CNTR: 1_uC (DD2.39), 2_PowerPerif (DA5.2 REL_AC_FB.0 VD3.2 VT2.2)
RELAY_PWR_CNTR: 1_uC (DD2.25), 2_PowerPerif (R15.2 R16.2)
RX: 1_uC (DD2.43 X1.5), 3_InfoPerif (R59.2 VD6.3 VD9.1)
SD_CS: 1_uC (R30.1), 3_InfoPerif (X8.1)
T_IRQ: 1_uC (R5.1), 3_InfoPerif (X8.2)
T_RES: 1_uC (R31.1), 3_InfoPerif (X8.4)
T_SCL: 1_uC (R4.1), 3_InfoPerif (X8.5)
T_SDA: 1_uC (R6.1), 3_InfoPerif (X8.3)
TX: 1_uC (DD2.42 X1.4), 3_InfoPerif (R57.2 VD6.1 VD9.2)
uC_LED: 1_uC (DD2.45), 3_InfoPerif (uC_LED.0 VD13.2)
Vbat: 1_uC (R35.1 VD1.1), 4_PowerSupplie (B1.1)